# Altium schematic sheet Servo_Driver.SchDoc
size A4; SheetNumber: 3; SheetTotal: 4
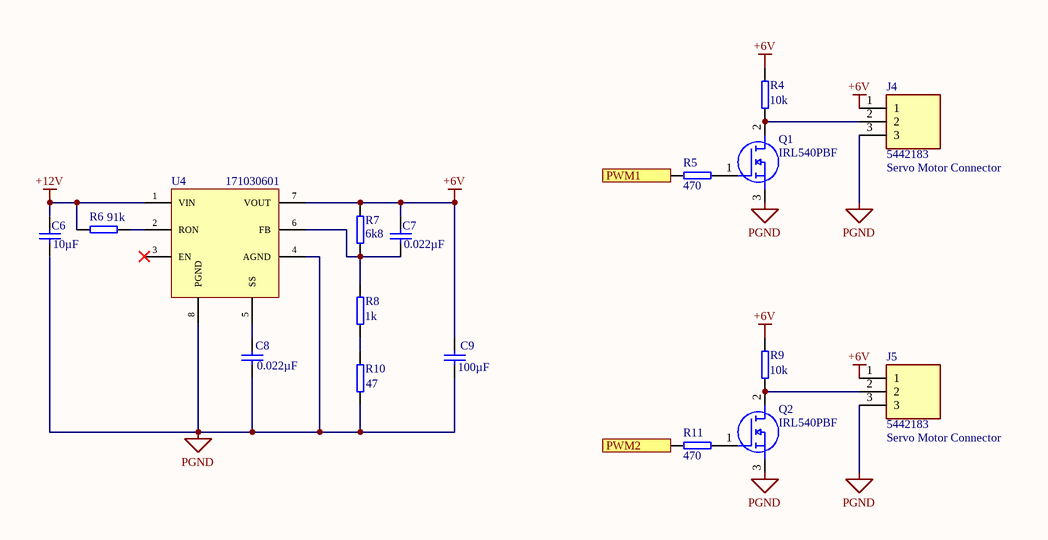
[diagram p0: Servo_Driver.SchDoc]

## Parts
C6  10µF  [Capacitor 0603]
C7  0.022µF  [Capacitor 0603]
C8  0.022µF  [Capacitor 0603]
C9  100µF  [Cap_1210]
J4  5442183  [5442183]
J5  5442183  [5442183]
Q1  IRL540PBF  [TO-220-3]
Q2  IRL540PBF  [TO-220-3]
R4  10k  [Resistor 0603]
R5  470  [Resistor 0603]
R6  91k  [Resistor 0603]
R7  6k8  [Resistor 0603]
R8  1k  [Resistor 0603]
R9  10k  [Resistor 0603]
R10  47  [Resistor 0603]
R11  470  [Resistor 0603]
U4  171030601  [TO263-7EP]

## Ports
PWM1 (in, see Main_Board_Tank[4B]), PWM2 (in, see Main_Board_Tank[4B])

## Nets
+6V: C7.1 C9.2 J4.1 J5.1 R4.1 R7.1 R9.1 U4.7(VOUT)
+12V: C6.1 R6.1 U4.1(VIN)
PGND: C6.2 C8.1 C9.1 J4.3 J5.3 Q1.3(S) Q2.3(S) R10.2 U4.4(AGND) U4.8(PGND)
PWM1: R5.1 ; port PWM1
PWM2: R11.1 ; port PWM2
NetC7_2: C7.2 R7.2 R8.1 U4.6(FB)
NetC8_2: C8.2 U4.5(SS)
NetJ4_2: J4.2 Q1.2(D) R4.2
NetJ5_2: J5.2 Q2.2(D) R9.2
NetQ1_1: Q1.1(G) R5.2
NetQ2_1: Q2.1(G) R11.2
NetR6_2: R6.2 U4.2(RON)
NetR8_2: R8.2 R10.1

Not connected (* = marked no-connect by the designer): U4 3(EN)*

## Notes on the sheet
- (near J4) Servo Motor Connector
- (near J5) Servo Motor Connector

## Library data of the parts
C6-C8 = Capacitor 0603: Capacitor
C9 = Capacitor 1210: Capacitor
J4 J5 = 5442183: Connector; Manufacturer_Name: Phoenix Contact; Datasheet Link: http://www.phoenixcontact.net/product/5442183; Height: 10.12mm; Manufacturer_Part_Number: 5442183; Mouser Part Number: 651-5442183; Mouser Price/Stock: https://www.mouser.co.uk/ProductDetail/Phoenix-Contact/5442183?qs=9Y9qB%2FCsC3nrqTUHTUeJoQ%3D%3D; Arrow Part Number: 5442183; Arrow Price/Stock: https://www.arrow.com/en/products/5442183/phoenix-contact?region=nac
Q1 Q2 = IRL540PBF: MOSFET N-CH  100V HEXFET MOSFET; Manufacturer_Name: Vishay; Geometry.Height: 4.65mm; Mouser Part Number: 844-IRL540PBF; Mouser Price/Stock: https://www.mouser.co.uk/ProductDetail/Vishay-Semiconductors/IRL540PBF?qs=cvaI6ThkwxvX4jX2UNqT3g%3D%3D; Manufacturer_Part_Number: IRL540PBF; Datasheet Link: https://componentsearchengine.com/Datasheets/1/IRL540PBF.pdf
R4-R11 = Resistor 0603: Resistor
U4 = CMP-533-000007-A.2: MagI3C-VDRM Variable Step Down Regulator Module, TO263-7EP, 6-42Vin, 3Aout; Manufacturer: Wurth Electronics; Input Voltage: 6-42V; Output Current: 3A; Output Voltage: 0.8-6V; ComponentLink1Description: Manufacturer; ComponentLink1URL: http://www.we-online.de; ComponentLink2Description: Datasheet; ComponentLink2URL: https://katalog.we-online.de/pm/datasheet/171030601.pdf; Mounting Technology: SMT; Operating Temperature: -40 to +125degC; Manufacturer Part Number: 171030601; Packaging: Tape and Reel; Published Date: April 2020; Size: TO263-7EP; Pin Count: 8; Source: MagI3C-VDRM_TO263-7EP.SchLib; Design Item ID: 171030601; Component Type: MagI3C VDRM